# Altium schematic sheet INDEX.SchDoc
size 420 x 297 mm; ApprovedBy: VU PHAM; CheckedBy: BAO BUI; Author: HUNG NGUYEN; SheetNumber: 1; SheetTotal: 2
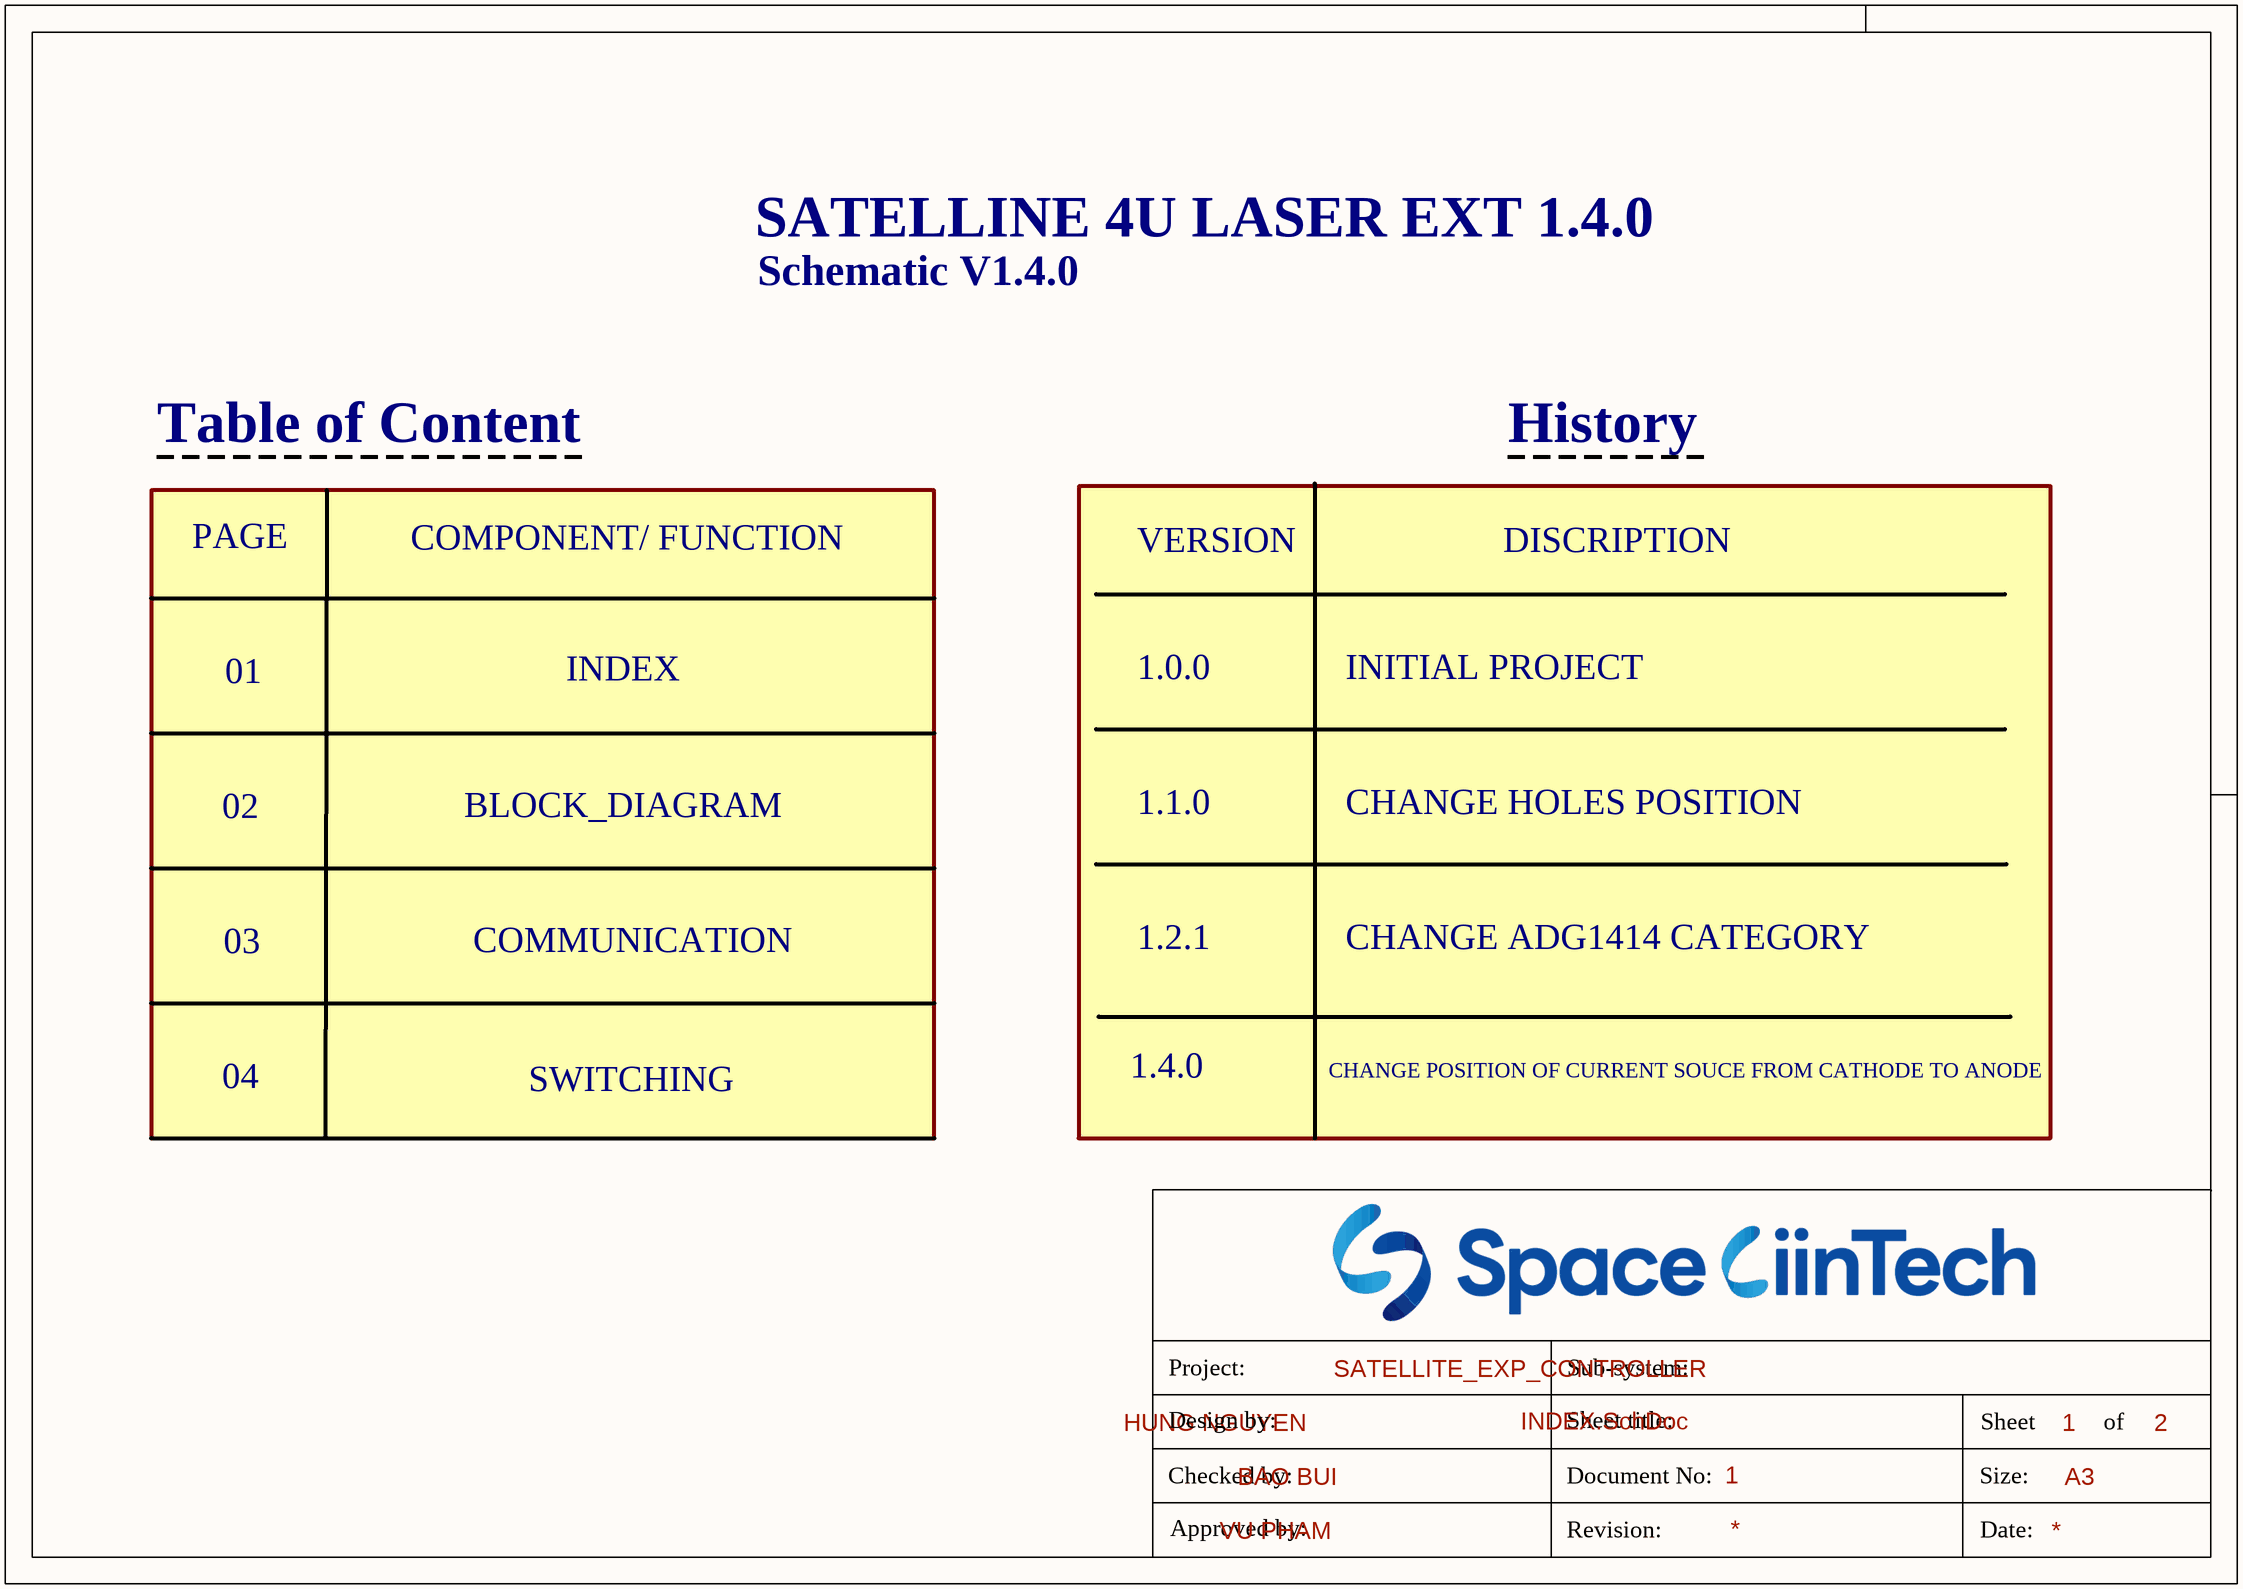
[diagram p0: INDEX.SchDoc]

## Notes on the sheet
- SATELLINE 4U LASER EXT 1.4.0
- Schematic V1.4.0
- Table of Content
- History
- COMPONENT/ FUNCTION
- PAGE
- VERSION
- DISCRIPTION
- INDEX
- 01
- 1.0.0
- INITIAL PROJECT
- BLOCK_DIAGRAM
- 02
- 1.1.0
- CHANGE HOLES POSITION
- COMMUNICATION
- 03
- 1.2.1
- CHANGE ADG1414 CATEGORY
- 04
- SWITCHING
- 1.4.0
- CHANGE POSITION OF CURRENT SOUCE FROM CATHODE TO ANODE
- Project:
- Sub-system:
- SATELLITE_EXP_CONTROLLER
- Design by:
- Sheet title:
- Sheet
- A3
- of
- Checked by:
- Approved by:
- Revision:
- Document No:
- Size:
- Date: